# Altium schematic sheet Gigabit Ethernet.SchDoc
size A3; Company Name: Renesas Electronics America; CompanyURL: www.renesas.com; PageSetup: Record=PageOptions|CenterHorizontal=True|CenterVertical=True|PrintScale=1.00|XCorrection=1.00|YCorrection=1.00|PrintKind=1|BorderSize=5000000|LeftOffset=0|BottomOffset=0|Orientation=2|PaperLength=1000|PaperWidth=1000|Scale=100|PaperSource=7|PrintQuality=-4|MediaType=1|DitherType=10|PaperKind=A5 148x210mm|PrintScaleMode=1; ReleaseDate: 16.09.2025; Version: MP; SheetNumber: 13; SheetTotal: 18; VariantNumber: 0; DSheetNumber: 1
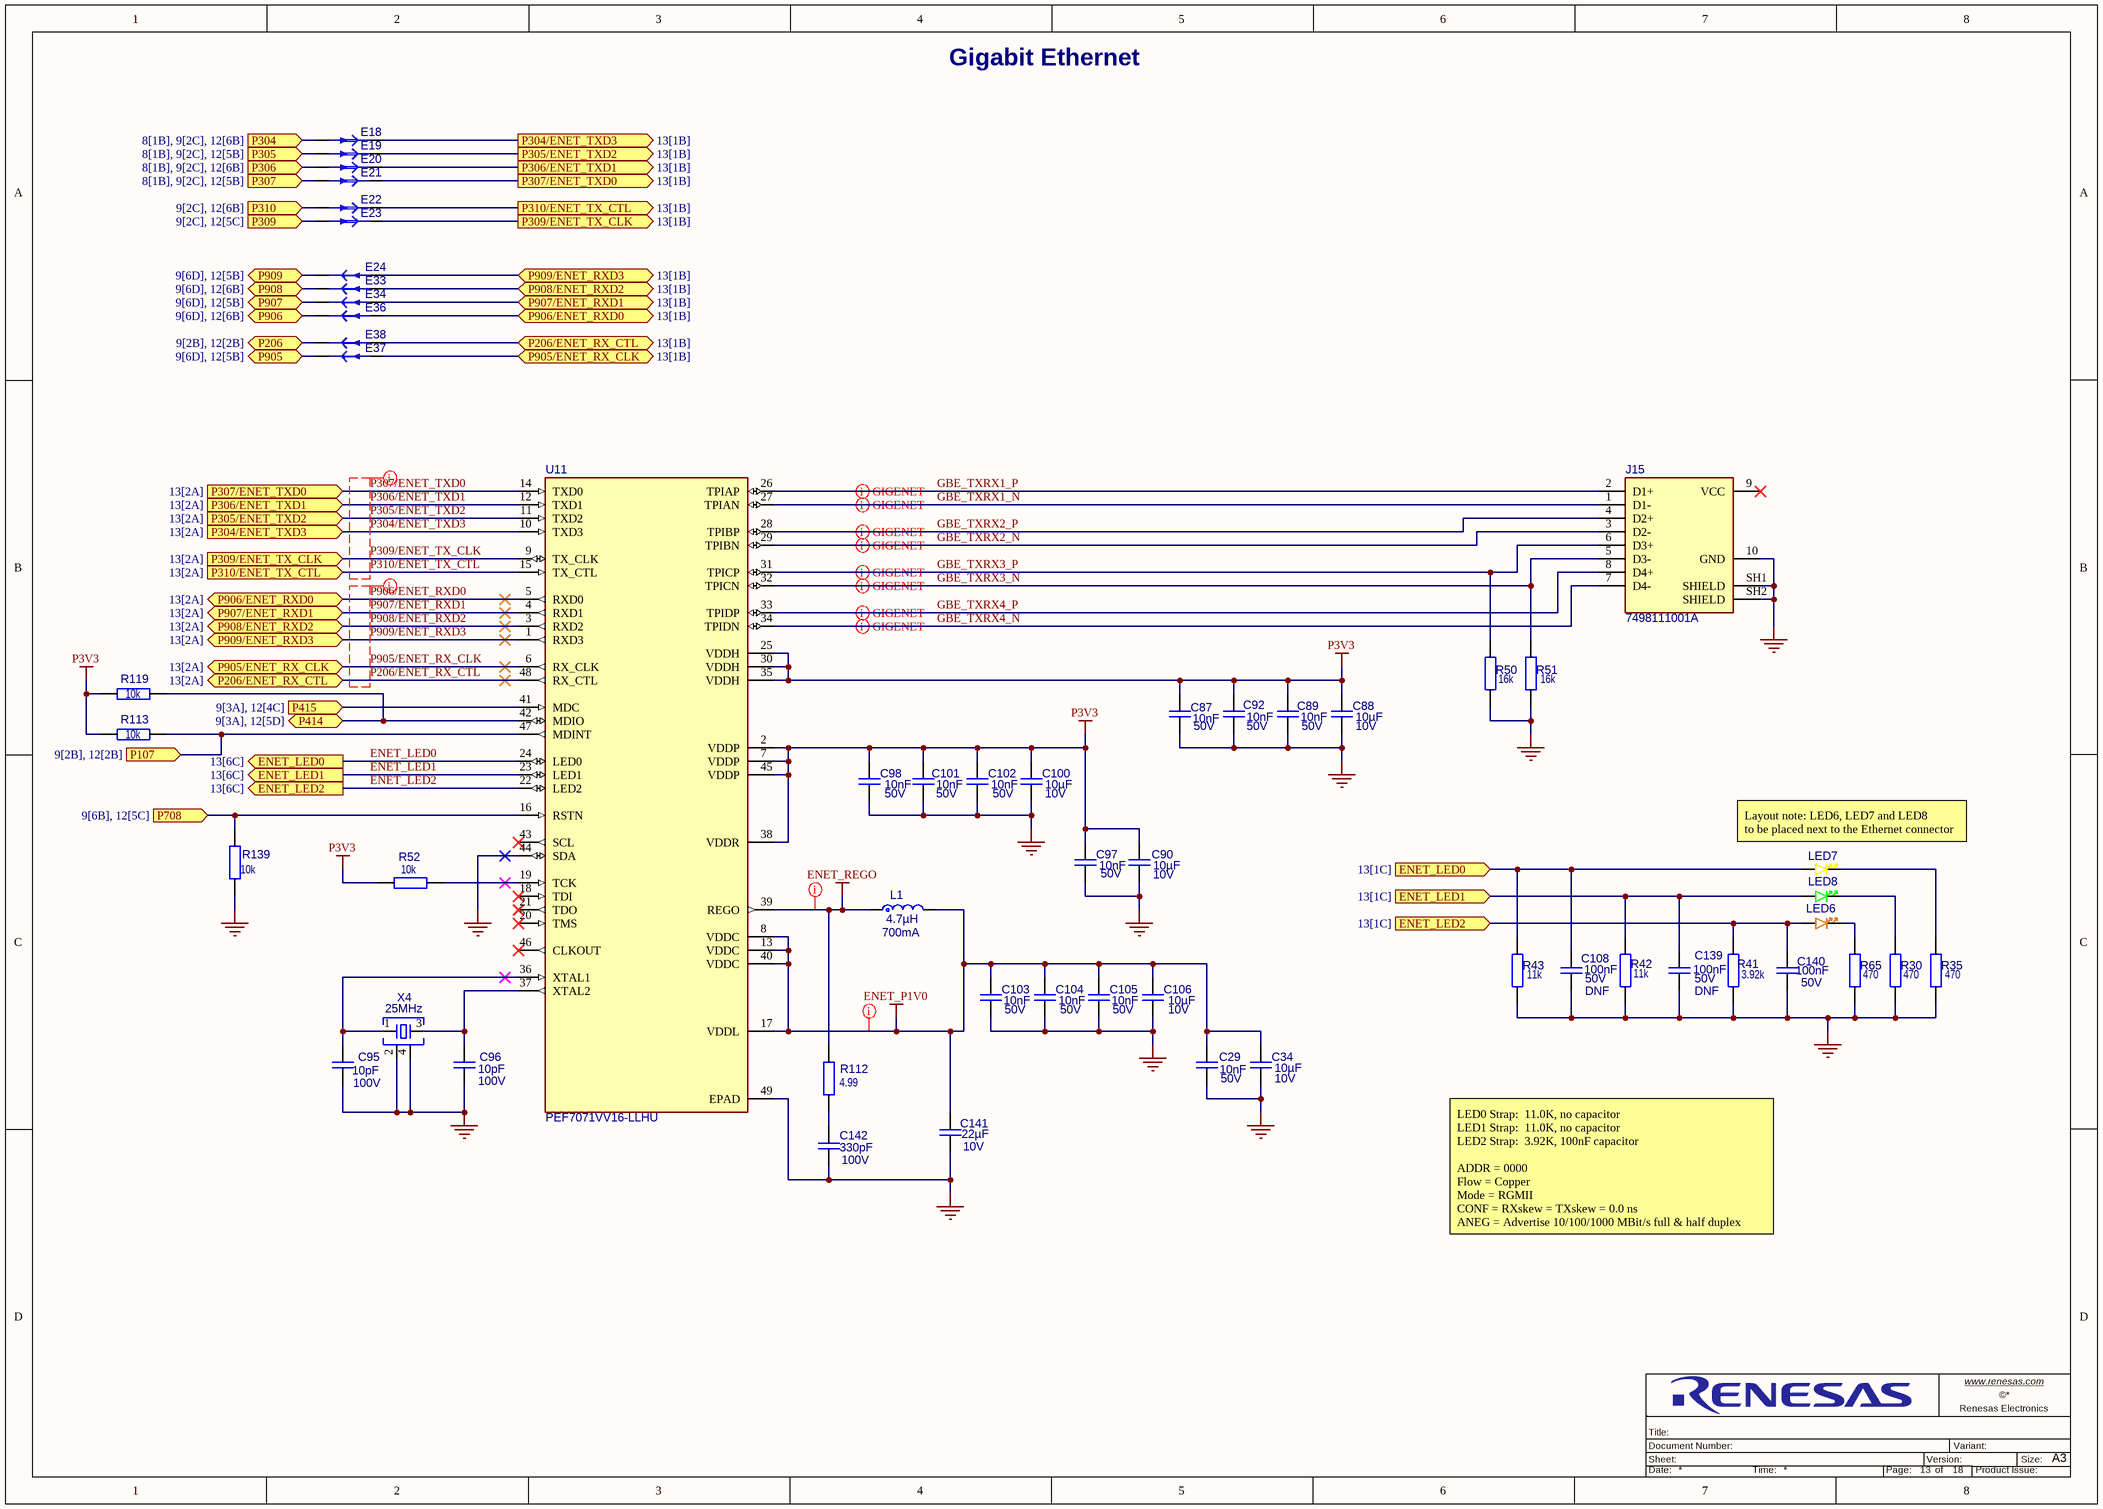
[diagram p0: Gigabit Ethernet.SchDoc]

## Parts
C29  value 10nF  Operating Voltage Max: 50V  [C_EIA0402_0p55]  (hidden comment: Capacitor)
C34  value 10µF  Operating Voltage Max: 10V  [C_EIA0402_0p7]  (hidden comment: Capacitor)
C87  value 10nF  Operating Voltage Max: 50V  [C_EIA0402_0p55]  (hidden comment: Capacitor)
C88  value 10µF  Operating Voltage Max: 10V  [C_EIA0402_0p7]  (hidden comment: Capacitor)
C89  value 10nF  Operating Voltage Max: 50V  [C_EIA0402_0p55]  (hidden comment: Capacitor)
C90  value 10µF  Operating Voltage Max: 10V  [C_EIA0402_0p7]  (hidden comment: Capacitor)
C92  value 10nF  Operating Voltage Max: 50V  [C_EIA0402_0p55]  (hidden comment: Capacitor)
C95  value 10pF  Operating Voltage Max: 100V  [C_EIA0402_0p55]  (hidden comment: Capacitor)
C96  value 10pF  Operating Voltage Max: 100V  [C_EIA0402_0p55]  (hidden comment: Capacitor)
C97  value 10nF  Operating Voltage Max: 50V  [C_EIA0402_0p55]  (hidden comment: Capacitor)
C98  value 10nF  Operating Voltage Max: 50V  [C_EIA0402_0p55]  (hidden comment: Capacitor)
C100  value 10µF  Operating Voltage Max: 10V  [C_EIA0402_0p7]  (hidden comment: Capacitor)
C101  value 10nF  Operating Voltage Max: 50V  [C_EIA0402_0p55]  (hidden comment: Capacitor)
C102  value 10nF  Operating Voltage Max: 50V  [C_EIA0402_0p55]  (hidden comment: Capacitor)
C103  value 10nF  Operating Voltage Max: 50V  [C_EIA0402_0p55]  (hidden comment: Capacitor)
C104  value 10nF  Operating Voltage Max: 50V  [C_EIA0402_0p55]  (hidden comment: Capacitor)
C105  value 10nF  Operating Voltage Max: 50V  [C_EIA0402_0p55]  (hidden comment: Capacitor)
C106  value 10µF  Operating Voltage Max: 10V  [C_EIA0402_0p7]  (hidden comment: Capacitor)
C108  value 100nF  Operating Voltage Max: 50V  [C_EIA0402_0p55]  (hidden comment: Capacitor)
C139  value 100nF  Operating Voltage Max: 50V  [C_EIA0402_0p55]  (hidden comment: Capacitor)
C140  value 100nF  Operating Voltage Max: 50V  [C_EIA0402_0p55]  (hidden comment: Capacitor)
C141  value 22µF  Operating Voltage Max: 10V  [C_EIA0402_0p9]  (hidden comment: Capacitor)
C142  value 330pF  Operating Voltage Max: 100V  [C_EIA0402_0p55]  (hidden comment: GCM155R72A331KA37D)
E18  TRACE_CUT_0805  [trace_cut_0805]  (value not drawn)  (net tie, no BOM)
E19  TRACE_CUT_0805  [trace_cut_0805]  (value not drawn)  (net tie, no BOM)
E20  TRACE_CUT_0805  [trace_cut_0805]  (value not drawn)  (net tie, no BOM)
E21  TRACE_CUT_0805  [trace_cut_0805]  (value not drawn)  (net tie, no BOM)
E22  TRACE_CUT_0805  [trace_cut_0805]  (value not drawn)  (net tie, no BOM)
E23  TRACE_CUT_0805  [trace_cut_0805]  (value not drawn)  (net tie, no BOM)
E24  TRACE_CUT_0805  [trace_cut_0805]  (value not drawn)  (net tie, no BOM)
E33  TRACE_CUT_0805  [trace_cut_0805]  (value not drawn)  (net tie, no BOM)
E34  TRACE_CUT_0805  [trace_cut_0805]  (value not drawn)  (net tie, no BOM)
E36  TRACE_CUT_0805  [trace_cut_0805]  (value not drawn)  (net tie, no BOM)
E37  TRACE_CUT_0805  [trace_cut_0805]  (value not drawn)  (net tie, no BOM)
E38  TRACE_CUT_0805  [trace_cut_0805]  (value not drawn)  (net tie, no BOM)
J15  7498111001A  [wue_7498111001A]
L1  value 4.7µH  Current: 700mA  [L_EIA0805]  (hidden comment: Inductor)
LED6  LO L29K-H2L1-24  [led_0603_o]  (value not drawn)
LED7  150060YS75000  [led_0603_y]  (value not drawn)
LED8  LG L29K-G2J1-24  [led_0603_g]  (value not drawn)
R30  value 470  [R_EIA0402]  (hidden comment: Resistor)
R35  value 470  [R_EIA0402]  (hidden comment: Resistor)
R41  value 3.92k  [R_EIA0402]  (hidden comment: Resistor)
R42  value 11k  [R_EIA0402]  (hidden comment: Resistor)
R43  value 11k  [R_EIA0402]  (hidden comment: Resistor)
R50  value 16k  [R_EIA0402]  (hidden comment: Resistor)
R51  value 16k  [R_EIA0402]  (hidden comment: Resistor)
R52  value 10k  [R_EIA0402]  (hidden comment: Resistor)
R65  value 470  [R_EIA0402]  (hidden comment: Resistor)
R112  value 4.99  [R_EIA0402]  (hidden comment: Resistor)
R113  value 10k  [R_EIA0402]  (hidden comment: Resistor)
R119  value 10k  [R_EIA0402]  (hidden comment: Resistor)
R139  value 10k  [R_EIA0402]  (hidden comment: RC0402FR-0710KL)
U11  PEF7071VV16-LLHU  [mxl_PG-VQFN-48_7x7]
X4  value 25MHz  [ecs-ECX-1637B]  (hidden comment: ECS-250-10-37B-CTN-TR)

## Ports
ENET_LED0 (in, see 13[1C]), ENET_LED0 (out, see 13[6C]), ENET_LED1 (in, see 13[1C]), ENET_LED1 (out, see 13[6C]), ENET_LED2 (in, see 13[1C]), ENET_LED2 (out, see 13[6C]), P107 (in, see 9[2B], 12[2B]), P206 (bidir, see 9[2B], 12[2B]), P206/ENET_RX_CTL (bidir, see 13[1B]), P206/ENET_RX_CTL (bidir, see 13[2A]), P304 (in, see 8[1B], 9[2C], 12[6B]), P304/ENET_TXD3 (in, see 13[2A]), P304/ENET_TXD3 (out, see 13[1B]), P305 (in, see 8[1B], 9[2C], 12[5B]), P305/ENET_TXD2 (in, see 13[2A]), P305/ENET_TXD2 (out, see 13[1B]), P306 (in, see 8[1B], 9[2C], 12[6B]), P306/ENET_TXD1 (in, see 13[2A]), P306/ENET_TXD1 (out, see 13[1B]), P307 (in, see 8[1B], 9[2C], 12[5B]), P307/ENET_TXD0 (in, see 13[2A]), P307/ENET_TXD0 (out, see 13[1B]), P309 (in, see 9[2C], 12[5C]), P309/ENET_TX_CLK (in, see 13[2A]), P309/ENET_TX_CLK (out, see 13[1B]), P310 (in, see 9[2C], 12[6B]), P310/ENET_TX_CTL (in, see 13[2A]), P310/ENET_TX_CTL (out, see 13[1B]), P414 (bidir, see 9[3A], 12[5D]), P415 (in, see 9[3A], 12[4C]), P708 (in, see 9[6B], 12[5C]), P905 (bidir, see 9[6D], 12[5B]), P905/ENET_RX_CLK (bidir, see 13[1B]), P905/ENET_RX_CLK (bidir, see 13[2A]), P906 (bidir, see 9[6D], 12[6B]), P906/ENET_RXD0 (bidir, see 13[1B]), P906/ENET_RXD0 (bidir, see 13[2A]), P907 (bidir, see 9[6D], 12[5B]), P907/ENET_RXD1 (bidir, see 13[1B]), P907/ENET_RXD1 (bidir, see 13[2A]), P908 (bidir, see 9[6D], 12[6B]), P908/ENET_RXD2 (bidir, see 13[1B]), P908/ENET_RXD2 (bidir, see 13[2A]), P909 (bidir, see 9[6D], 12[5B]), P909/ENET_RXD3 (bidir, see 13[1B]), P909/ENET_RXD3 (bidir, see 13[2A])

## Nets
ENET_P1V0: C29.1 C34.1 C103.1 C104.1 C105.1 C106.1 C141.2 L1.2 U11.8(VDDC) U11.13(VDDC) U11.17(VDDL) U11.40(VDDC)
ENET_REGO: L1.1 R112.2 U11.39(REGO)
GND: C29.2 C34.2 C87.2 C88.2 C89.2 C90.2 C92.2 C95.1 C96.2 C97.2 C98.2 C100.2 C101.2 C102.2 C103.2 C104.2 C105.2 C106.2 C108.2 C139.2 C140.2 C141.1 C142.1 J15.10(GND) J15.SH1(SHIELD) J15.SH2(SHIELD) R30.1 R35.1 R41.1 R42.1 R43.1 R50.1 R51.1 R65.1 R139.1 U11.44(SDA) U11.49(EPAD) X4.2 X4.4
P3V3: C87.1 C88.1 C89.1 C90.1 C92.1 C97.1 C98.1 C100.1 C101.1 C102.1 R52.1 R113.1 R119.1 U11.2(VDDP) U11.7(VDDP) U11.25(VDDH) U11.30(VDDH) U11.35(VDDH) U11.38(VDDR) U11.45(VDDP)
ENET_LED0: C108.1 LED7.2(A) R43.2 U11.24(LED0) ; port ENET_LED0
ENET_LED1: C139.1 LED8.2(A) R42.2 U11.23(LED1) ; port ENET_LED1
ENET_LED2: C140.1 LED6.2(A) R41.2 U11.22(LED2) ; port ENET_LED2
GBE_TXRX1_N: J15.1(D1-) U11.27(TPIAN)
GBE_TXRX1_P: J15.2(D1+) U11.26(TPIAP)
GBE_TXRX2_N: J15.3(D2-) U11.29(TPIBN)
GBE_TXRX2_P: J15.4(D2+) U11.28(TPIBP)
GBE_TXRX3_N: J15.5(D3-) R51.2 U11.32(TPICN)
GBE_TXRX3_P: J15.6(D3+) R50.2 U11.31(TPICP)
GBE_TXRX4_N: J15.7(D4-) U11.34(TPIDN)
GBE_TXRX4_P: J15.8(D4+) U11.33(TPIDP)
P107: R113.2 U11.47(MDINT) ; port P107
P206: E38.1 ; port P206
P206/ENET_RX_CTL: E38.2 U11.48(RX_CTL) ; port P206/ENET_RX_CTL
P304: E18.2 ; port P304
P304/ENET_TXD3: E18.1 U11.10(TXD3) ; port P304/ENET_TXD3
P305: E19.2 ; port P305
P305/ENET_TXD2: E19.1 U11.11(TXD2) ; port P305/ENET_TXD2
P306: E20.2 ; port P306
P306/ENET_TXD1: E20.1 U11.12(TXD1) ; port P306/ENET_TXD1
P307: E21.2 ; port P307
P307/ENET_TXD0: E21.1 U11.14(TXD0) ; port P307/ENET_TXD0
P309: E23.2 ; port P309
P309/ENET_TX_CLK: E23.1 U11.9(TX_CLK) ; port P309/ENET_TX_CLK
P310: E22.2 ; port P310
P310/ENET_TX_CTL: E22.1 U11.15(TX_CTL) ; port P310/ENET_TX_CTL
P414: R119.2 U11.42(MDIO) ; port P414
P415: U11.41(MDC) ; port P415
P708: R139.2 U11.16(RSTN) ; port P708
P905: E37.1 ; port P905
P905/ENET_RX_CLK: E37.2 U11.6(RX_CLK) ; port P905/ENET_RX_CLK
P906: E36.1 ; port P906
P906/ENET_RXD0: E36.2 U11.5(RXD0) ; port P906/ENET_RXD0
P907: E34.1 ; port P907
P907/ENET_RXD1: E34.2 U11.4(RXD1) ; port P907/ENET_RXD1
P908: E33.1 ; port P908
P908/ENET_RXD2: E33.2 U11.3(RXD2) ; port P908/ENET_RXD2
P909: E24.1 ; port P909
P909/ENET_RXD3: E24.2 U11.1(RXD3) ; port P909/ENET_RXD3
NetC95_2: C95.2 U11.36(XTAL1) X4.1
NetC96_1: C96.1 U11.37(XTAL2) X4.3
NetC142_2: C142.2 R112.1
NetLED6_1: LED6.1(K) R65.2
NetLED7_1: LED7.1(K) R35.2
NetLED8_1: LED8.1(K) R30.2
NetR52_2: R52.2 U11.19(TCK)

Not connected (* = marked no-connect by the designer): J15 9(VCC)*; U11 18(TDI)* 20(TMS)* 21(TDO)* 43(SCL)* 46(CLKOUT)*

## Layout directives
differential pair; net class GigENET; differential pair class GBE_TXRX1: GBE_TXRX1_N, GBE_TXRX1_P
differential pair; net class GigENET; differential pair class GBE_TXRX2: GBE_TXRX2_N, GBE_TXRX2_P
differential pair; net class GigENET; differential pair class GBE_TXRX3: GBE_TXRX3_N, GBE_TXRX3_P
differential pair; net class GigENET; differential pair class GBE_TXRX4: GBE_TXRX4_N, GBE_TXRX4_P
net class Power; rule Supply Nets [Voltage = 1.000]: ENET_P1V0, ENET_REGO
net class RGMII_RX: P206/ENET_RX_CTL, P905/ENET_RX_CLK, P906/ENET_RXD0, P907/ENET_RXD1, P908/ENET_RXD2, P909/ENET_RXD3
net class RGMII_TX: P304/ENET_TXD3, P305/ENET_TXD2, P306/ENET_TXD1, P307/ENET_TXD0, P309/ENET_TX_CLK, P310/ENET_TX_CTL

## Notes on the sheet
- Gigabit Ethernet
- (near LED7) Layout note: LED6, LED7 and LED8
  to be placed next to the Ethernet connector
- LED0 Strap:  11.0K, no capacitor
  LED1 Strap:  11.0K, no capacitor
  LED2 Strap:  3.92K, 100nF capacitor
  ADDR = 0000
  Flow = Copper
  Mode = RGMII
  CONF = RXskew = TXskew = 0.0 ns
  ANEG = Advertise 10/100/1000 MBit/s full & half duplex
- www.renesas.com <http://www.renesas.com>
- Sheet:
- Title:
- Document Number:
- Version:
- Variant:
- Renesas Electronics
- Size:
- A3
- Date:
- Time:
- Page:
- of
- Product Issue:

## Library data of the parts
C29 C87 C89 C92 C97 C98 C101-C105 = CAP-00003212-9: Capacitor,EIA0402,10n,50V,X7R; Tolerance: 10%; Qualification: AEC-Q200; Subtype: MLCC; Dielectric: X7R; Height: 550µm; Operating Temperature Max: 125°C; Operating Temperature Min: -55°C
C34 C88 C90 C100 C106 = CAP-00003447-8: Capacitor,EIA0402,10u,10V,X5R; Tolerance: 20%; Subtype: MLCC; Dielectric: X5R; Height: 700µm; Operating Temperature Max: 85°C; Operating Temperature Min: -55°C; Qualification: -
C95 C96 = CAP-00003215-9: Capacitor,EIA0402,10p,100V,C0G; Tolerance: 5%; Qualification: AEC-Q200; Subtype: MLCC; Dielectric: C0G; Height: 550µm; Operating Temperature Max: 125°C; Operating Temperature Min: -55°C
C108 C139 C140 = CAP-00003203-9: Capacitor,EIA0402,100n,50V,X7R; Tolerance: 10%; Qualification: AEC-Q200; Subtype: MLCC; Dielectric: X7R; Height: 550µm; Operating Temperature Max: 125°C; Operating Temperature Min: -55°C
  C108 C139: DNF: DNF
C141 = CAP-00000013-4: Capacitor,EIA0402,22u,10V,X5R; Tolerance: 20%; Subtype: MLCC; Dielectric: X5R; Height: 900µm; Operating Temperature Max: 85°C; Operating Temperature Min: -55°C; Qualification: -
C142 = CAP-00000002-8: Capacitor,EIA0402,330p,100V,X7R; Tolerance: 10%; Qualification: AEC-Q200; Subtype: MLCC; Dielectric: X7R; Height: 550µm; Operating Temperature Max: 125°C; Operating Temperature Min: -55°C
E18-E24 E33 E34 E36-E38 = MIS-00000000-11: Trace Cut, SMD, 0805 size; Value: TC; Pin Count: 2; Qualification: -; Subtype: Trace Cut
J15 = CON-00000088-4: 10/100/1000 Ethernet Jack, RJ45, Right Angle SMT, No LEDs; Gender: female; Operating Temperature Min: -40°C; Qualification: -; Operating Temperature Max: 85°C; Pin Count: 10; Height: 13.55mm
L1 = IND-00000002-6: Power Inductor Shielded Multilayer 4.7uH 20% 3MHz Ferrite 700mA; DC Resistance: 0.26; Subtype: Fixed; Tolerance: 20%; Frequency: 3MHz; Height: 1mm; Operating Temperature Max: 125°C; Operating Temperature Min: -55°C; Qualification: -
LED6 = DIO-00003241-14: Standard LEDs - SMD Orange, 606nm 3.55 to 14 mcd; Qualification: AEC-Q101; Reverse Voltage: 12V; Current: 2mA; Subtype: LED; Forward Voltage: 1.8V; Operating Temperature Min: -40°C; Operating Temperature Max: 100°C; Height: 650µm
LED7 = DIO-00000015-5: Standard LEDs - SMD Yellow, 590nm 90 to 120 mcd; Subtype: LED; Reverse Voltage: 5V; Current: 30mA; Forward Voltage: 2V; Operating Temperature Min: -40°C; Height: 800µm; Qualification: -; Operating Temperature Max: 85°C
LED8 = DIO-00003239-15: Standard LEDs - SMD Green, 570nm 2.2 to 5.6 mcd; Current: 2mA; Forward Voltage: 1.7V; Qualification: AEC-Q101; Reverse Voltage: 12V; Subtype: LED; Height: 650µm; Operating Temperature Max: 100°C; Operating Temperature Min: -40°C
R30 R35 R65 = RES-00000870-9: Resistor,EIA0402,470,0.0625W; Power: 62.5mW; Tolerance: 1%; Subtype: Chip Resistor; Operating Temperature Max: 155°C; Operating Temperature Min: -55°C; Qualification: -
R41 = RES-00001635-10: Resistor,EIA0402,3.92k,0.0625W; Power: 62.5mW; Tolerance: 1%; Subtype: Chip Resistor; Operating Temperature Max: 155°C; Operating Temperature Min: -55°C; Qualification: -
R42 R43 = RES-00000903-9: Resistor,EIA0402,11k,0.0625W; Power: 62.5mW; Tolerance: 1%; Subtype: Chip Resistor; Operating Temperature Max: 155°C; Operating Temperature Min: -55°C; Qualification: -
R50 R51 = RES-00000907-9: Resistor,EIA0402,16k,0.0625W; Power: 62.5mW; Tolerance: 1%; Subtype: Chip Resistor; Operating Temperature Max: 155°C; Operating Temperature Min: -55°C; Qualification: -
R52 R113 R119 R139 = RES-00000902-9: Resistor,EIA0402,10k,0.0625W; Power: 62.5mW; Tolerance: 1%; Subtype: Chip Resistor; Operating Temperature Max: 155°C; Operating Temperature Min: -55°C; Qualification: -
R112 = RES-00001375-9: Resistor,EIA0402,4.99,0.0625W; Power: 62.5mW; Tolerance: 1%; Subtype: Chip Resistor; Operating Temperature Max: 155°C; Operating Temperature Min: -55°C; Qualification: -
U11 = ICS-00000025-10: Ethernet Network Connection GPY111 Gigabit Ethernet (GbE); Operating Voltage Max: 3.47V; Operating Voltage Min: 2.37V; Subtype: Transceiver; Operating Temperature Min: -40°C; Pin Count: 49; Operating Temperature Max: 85°C; Qualification: -
X4 = CRY-00000003-9: Crystal, 25.000MHz, 10 pF, 2x1.6; Load Capacitance: 10pF; Tolerance: 10ppm; Height: 500µm; Operating Temperature Max: 85°C; Operating Temperature Min: -40°C; Qualification: -; Subtype: Crystal